# Altium schematic sheet top.SchDoc
size A4; SheetNumber: 1; SheetTotal: 4
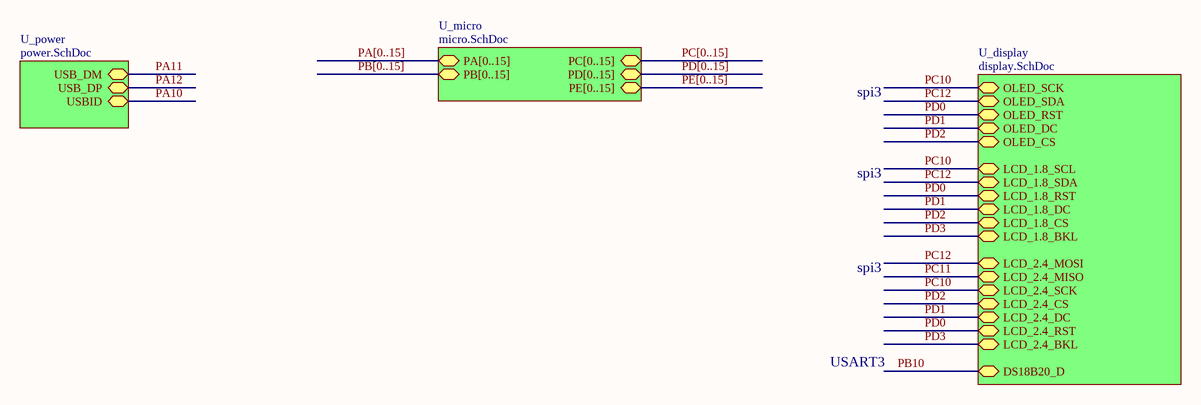
[diagram p0: top.SchDoc]

## Sub-sheets
U_display = display.SchDoc: OLED_SCK (bidir), OLED_SDA (bidir), OLED_RST (bidir), OLED_DC (bidir), OLED_CS (bidir), LCD_1.8_SCL (bidir), LCD_1.8_SDA (bidir), LCD_1.8_RST (bidir), LCD_1.8_DC (bidir), LCD_1.8_CS (bidir), LCD_1.8_BKL (bidir), LCD_2.4_CS (bidir), LCD_2.4_RST (bidir), LCD_2.4_DC (bidir), LCD_2.4_MOSI (bidir), LCD_2.4_SCK (bidir), LCD_2.4_BKL (bidir), LCD_2.4_MISO (bidir), DS18B20_D (bidir)
U_micro = micro.SchDoc: PA[0..15] (bidir), PB[0..15] (bidir), PC[0..15] (bidir), PD[0..15] (bidir), PE[0..15] (bidir)
U_power = power.SchDoc: USB_DM (bidir), USB_DP (bidir), USBID (bidir)

## Nets
PA10: sheet U_power/USBID
PA11: sheet U_power/USB_DM
PA12: sheet U_power/USB_DP
PB10: sheet U_display/DS18B20_D
PC10: sheet U_display/OLED_SCK, sheet U_display/LCD_1.8_SCL, sheet U_display/LCD_2.4_SCK
PC11: sheet U_display/LCD_2.4_MISO
PC12: sheet U_display/OLED_SDA, sheet U_display/LCD_1.8_SDA, sheet U_display/LCD_2.4_MOSI
PD0: sheet U_display/OLED_RST, sheet U_display/LCD_1.8_RST, sheet U_display/LCD_2.4_RST
PD1: sheet U_display/OLED_DC, sheet U_display/LCD_1.8_DC, sheet U_display/LCD_2.4_DC
PD2: sheet U_display/OLED_CS, sheet U_display/LCD_1.8_CS, sheet U_display/LCD_2.4_CS
PD3: sheet U_display/LCD_1.8_BKL, sheet U_display/LCD_2.4_BKL

## Buses and harness runs
bus PA[0..15] = sheet U_micro/PA[0..15]
bus PB[0..15] = sheet U_micro/PB[0..15]
bus PC[0..15] = sheet U_micro/PC[0..15]
bus PD[0..15] = sheet U_micro/PD[0..15]
bus PE[0..15] = sheet U_micro/PE[0..15]

## Notes on the sheet
- spi3
- USART3